# Altium schematic sheet INA228.SchDoc: =DocumentName
size 297 x 209 mm; CompanyName: "AS Manufacturing" LLC; Organization: "AS Manufacturing" LLC; Address1: 5 Sklyarenka St.; Address2: Kyiv 04073; Address3: Ukraine; Address4: https://ajax.systems/en/; DocumentNumber: 5; SheetNumber: 5; SheetTotal: 7; Template_version: 1.0.1
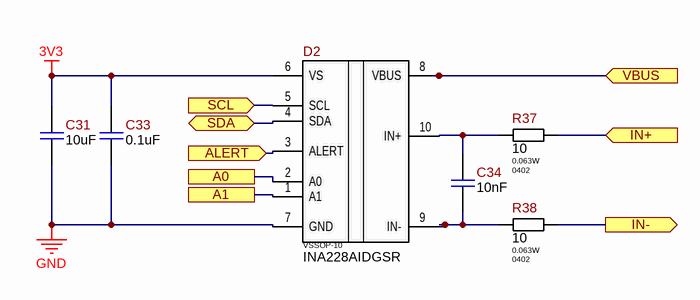
[diagram p0: INA228.SchDoc]

## Parts
C31  10uF  [C0402(1005)]
C33  0.1uF  [C0402(1005)]
C34  10nF  [C0402(1005)]
D2  Package: VSSOP-10  [TI-VSSOP-10-50P490X110]  (hidden comment: INA228AIDGSR)
R37  10  Power Rating: 0.063W  Package/Case: 0402  [R0402]
R38  10  Power Rating: 0.063W  Package/Case: 0402  [R0402]

## Ports
A0, A1, ALERT (in), IN+ (in), IN- (out), SCL (in), SDA (bidir), VBUS (in)

## Nets
3V3: C31.2 C33.2 D2.6(VS)
GND: C31.1 C33.1 D2.7(GND)
A0: D2.2(A0) ; port A0
A1: D2.1(A1) ; port A1
ALERT: D2.3(ALERT) ; port ALERT
IN+: R37.2 ; port IN+
IN-: R38.2 ; port IN-
SCL: D2.5(SCL) ; port SCL
SDA: D2.4(SDA) ; port SDA
VBUS: D2.8(VBUS) ; port VBUS
NetC34_1: C34.1 D2.9(IN-) R38.1
NetC34_2: C34.2 D2.10(IN+) R37.1

## Notes on the sheet
- 1
- 2
- 3
- 4
- 5
- 6
- C
- D
- E
- F
- Назва проекту
- Мова
- UA
- Розробник
- Формат
- A4
- Версія
- Дата
- Лист
- /

## Library data of the parts
C31 = 10uF  6.3V C0402: CAP CER 10UF 6.3V X6S 0402; Manufacturer: Murata Electronics North America; Manufacturer P/N: GRM155C80J106ME11D; Name Component: Capacitor Ceramic; Tolerance: ±20%; Operation Temperature: -55°C ~ 105°C; Library Path 1: Capacitors.SchLib; Part Number: 10uF  6.3V C0402; Value: 10uF; Temperature Coefficient: X6S; Power (V/A): 6.3V; Package/Case: C0402; Supplier 1: Digi-key; Supplier Part Number 1: 490-13233-2-ND; ComponentLink1Description: Datasheet; ComponentLink1URL: https://www.murata.com/~/media/webrenewal/support/library/catalog/products/capacitor/mlcc/c02e.ashx?la=en-us
C33 = 0.1uF  25V C0403: CAP CER 0.1UF 25V X7R 0603; Manufacturer: Samsung Electro-Mechanics; Name Component: Capacitor Ceramic; Tolerance: ±10%; Operation Temperature: -55°C ~ 125°C; Library Path 1: Capacitors.SchLib; Part Number: 0.1uF  25V C0403; Value: 0.1uF; Temperature Coefficient: X7R; Power (V/A): 25V; Package/Case: C0403; Supplier Part Number 1: 1276-6854-2-ND; ComponentLink1Description: Datasheet
C34 = 10nF  50V C0402: CAP CER 10NF 50V NP0 0603; Manufacturer: AVX Corporation; Name Component: Capacitor Ceramic; Tolerance: ±0.25pF; Operation Temperature: -55°C ~ 105°C; Temperature Coefficient: C0G, NP0; Library Path 1: Capacitors.SchLib; Part Number: 10nF  50V C0402; Value: 10nF; Power (V/A): 50V; Package/Case: C0402; Supplier 1: Digi-key; ComponentLink1Description: Datasheet
D2 = INA228AIDGSR: 85V, 20Bit, Ultra-Precise Power/Energy/Charge Monitor With I2C, 2.7V to 5.5V Supply, VSSOP-10; Manufacturer: Texas Instruments; Ajax_1C_ID: 73549; Ajax_1C_PN: INA228AIDGSR IC Power Supply Controller VSSOP-10 TI; Ajax_1С_Status: Mass Production; Component Status: Released; Standard Lead Time: 57 Weeks; Replacement: NONE; GUID_1C: d5df315a-0f3b-11ee-a36c-005056994834; Part Number: INA228AIDGSR; Part Type: Amplifier / Current Sense; Component Type: SMD; Temperature Range: -40°C ~ 125°C; ComponentLink1URL: https://www.ti.com/lit/ds/symlink/ina228.pdf; Supplier 1: Digi-Key; Supplier Part Number 1: 296-INA228AIDGSRTR-ND; Price: 3.28; ComponentLink1Description: Datasheet
R37 R38 = 10  R0402: RES SMD 10 OHM  ±1% 1/16W 0402; Name Component: Resistror; Operation Temperature: -55℃ to 155℃; Temperature Coefficient: ±200 ppm/°C; Library Path 1: Resistor.SchLib; Part Number: 10  R0402; Value: 10; Tolerance: ±1%